# EAGLE schematic WB_2.8 (EAGLE 6.4)
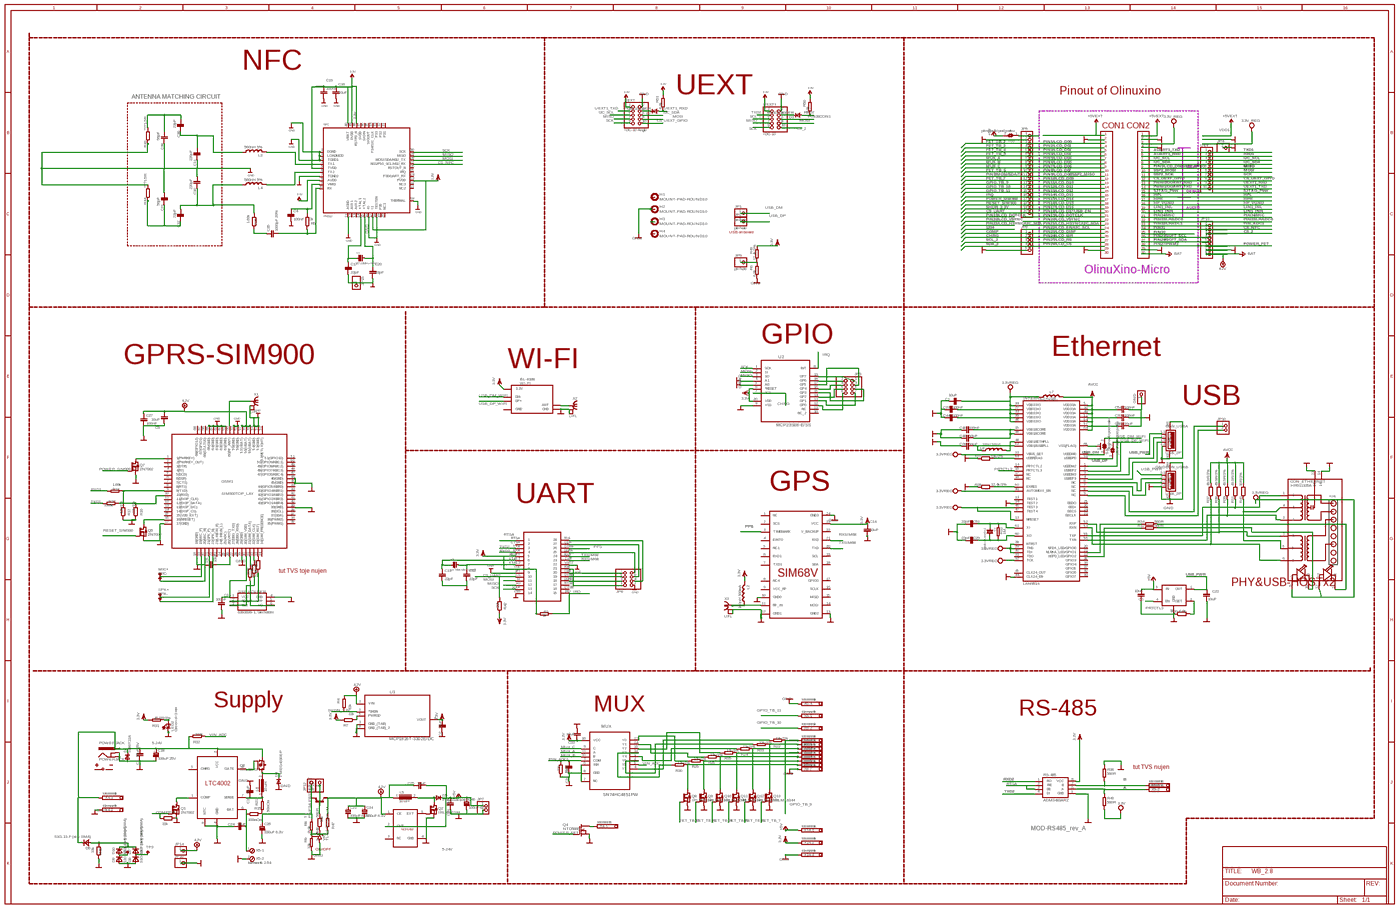
[diagram p0: schematic, sheet 1, overview]
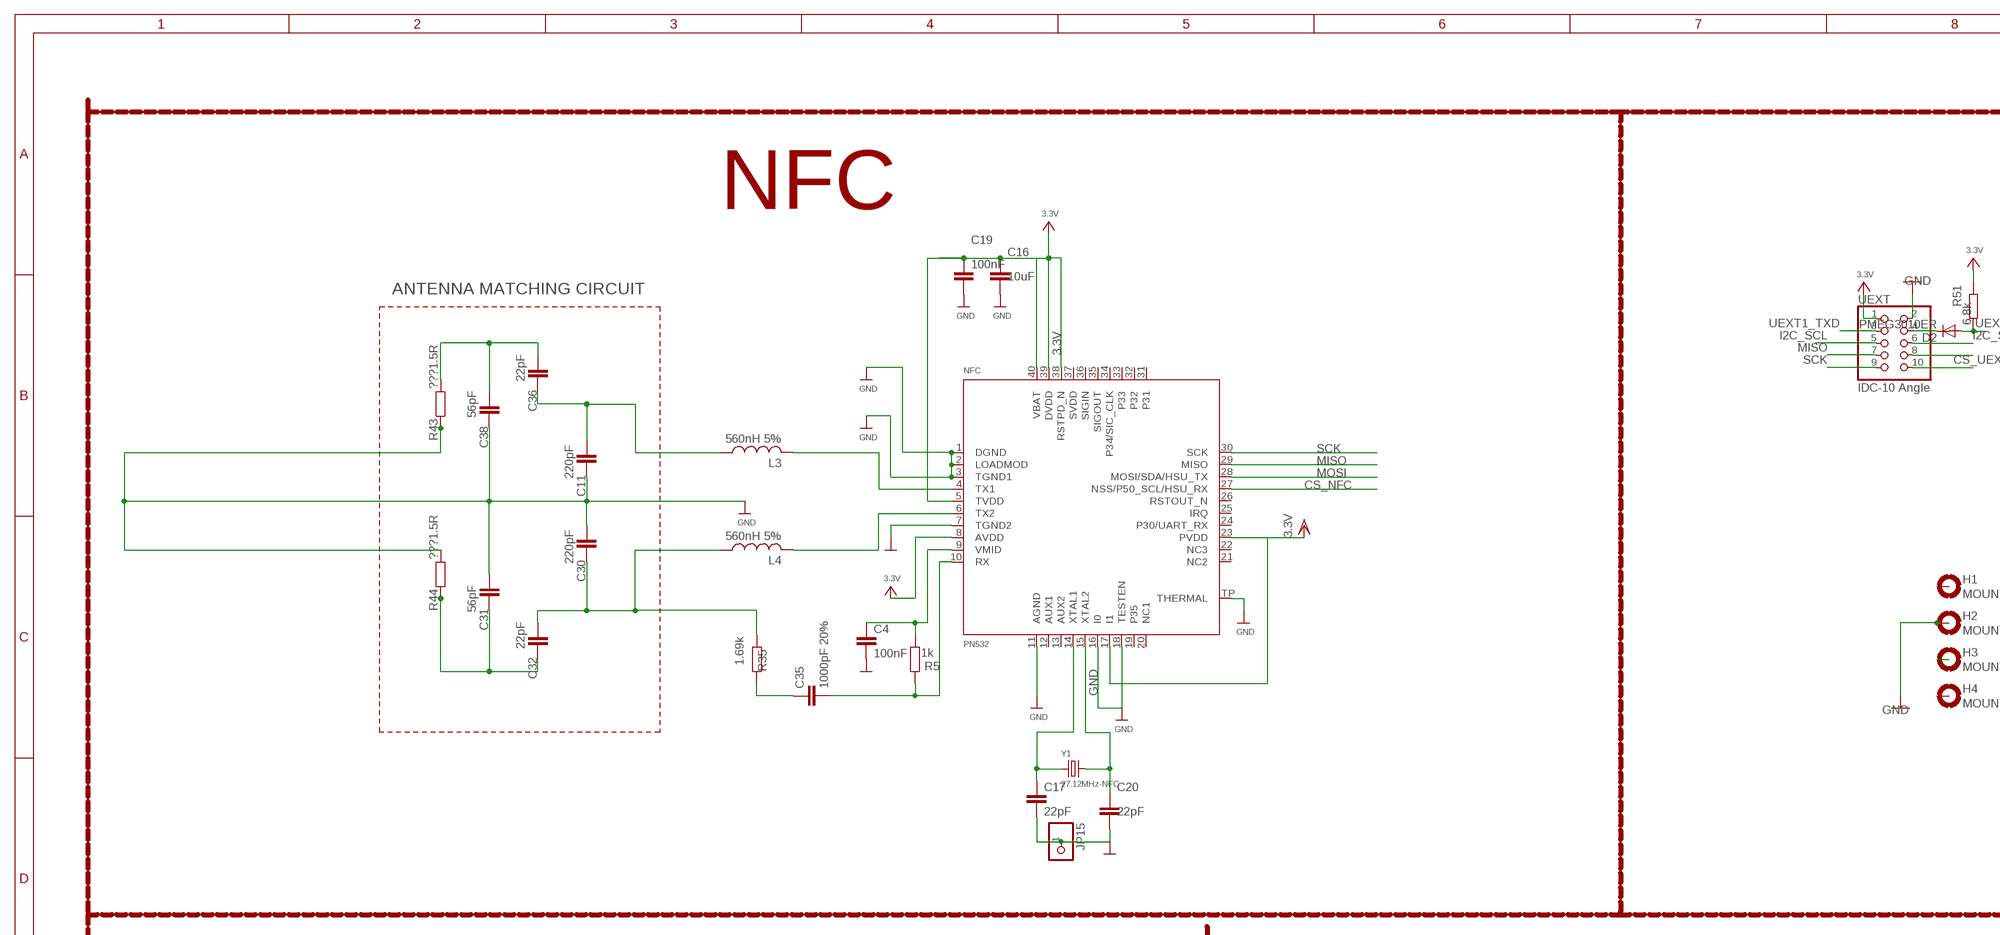
[diagram p1: schematic, sheet 1, part 1 of 4]
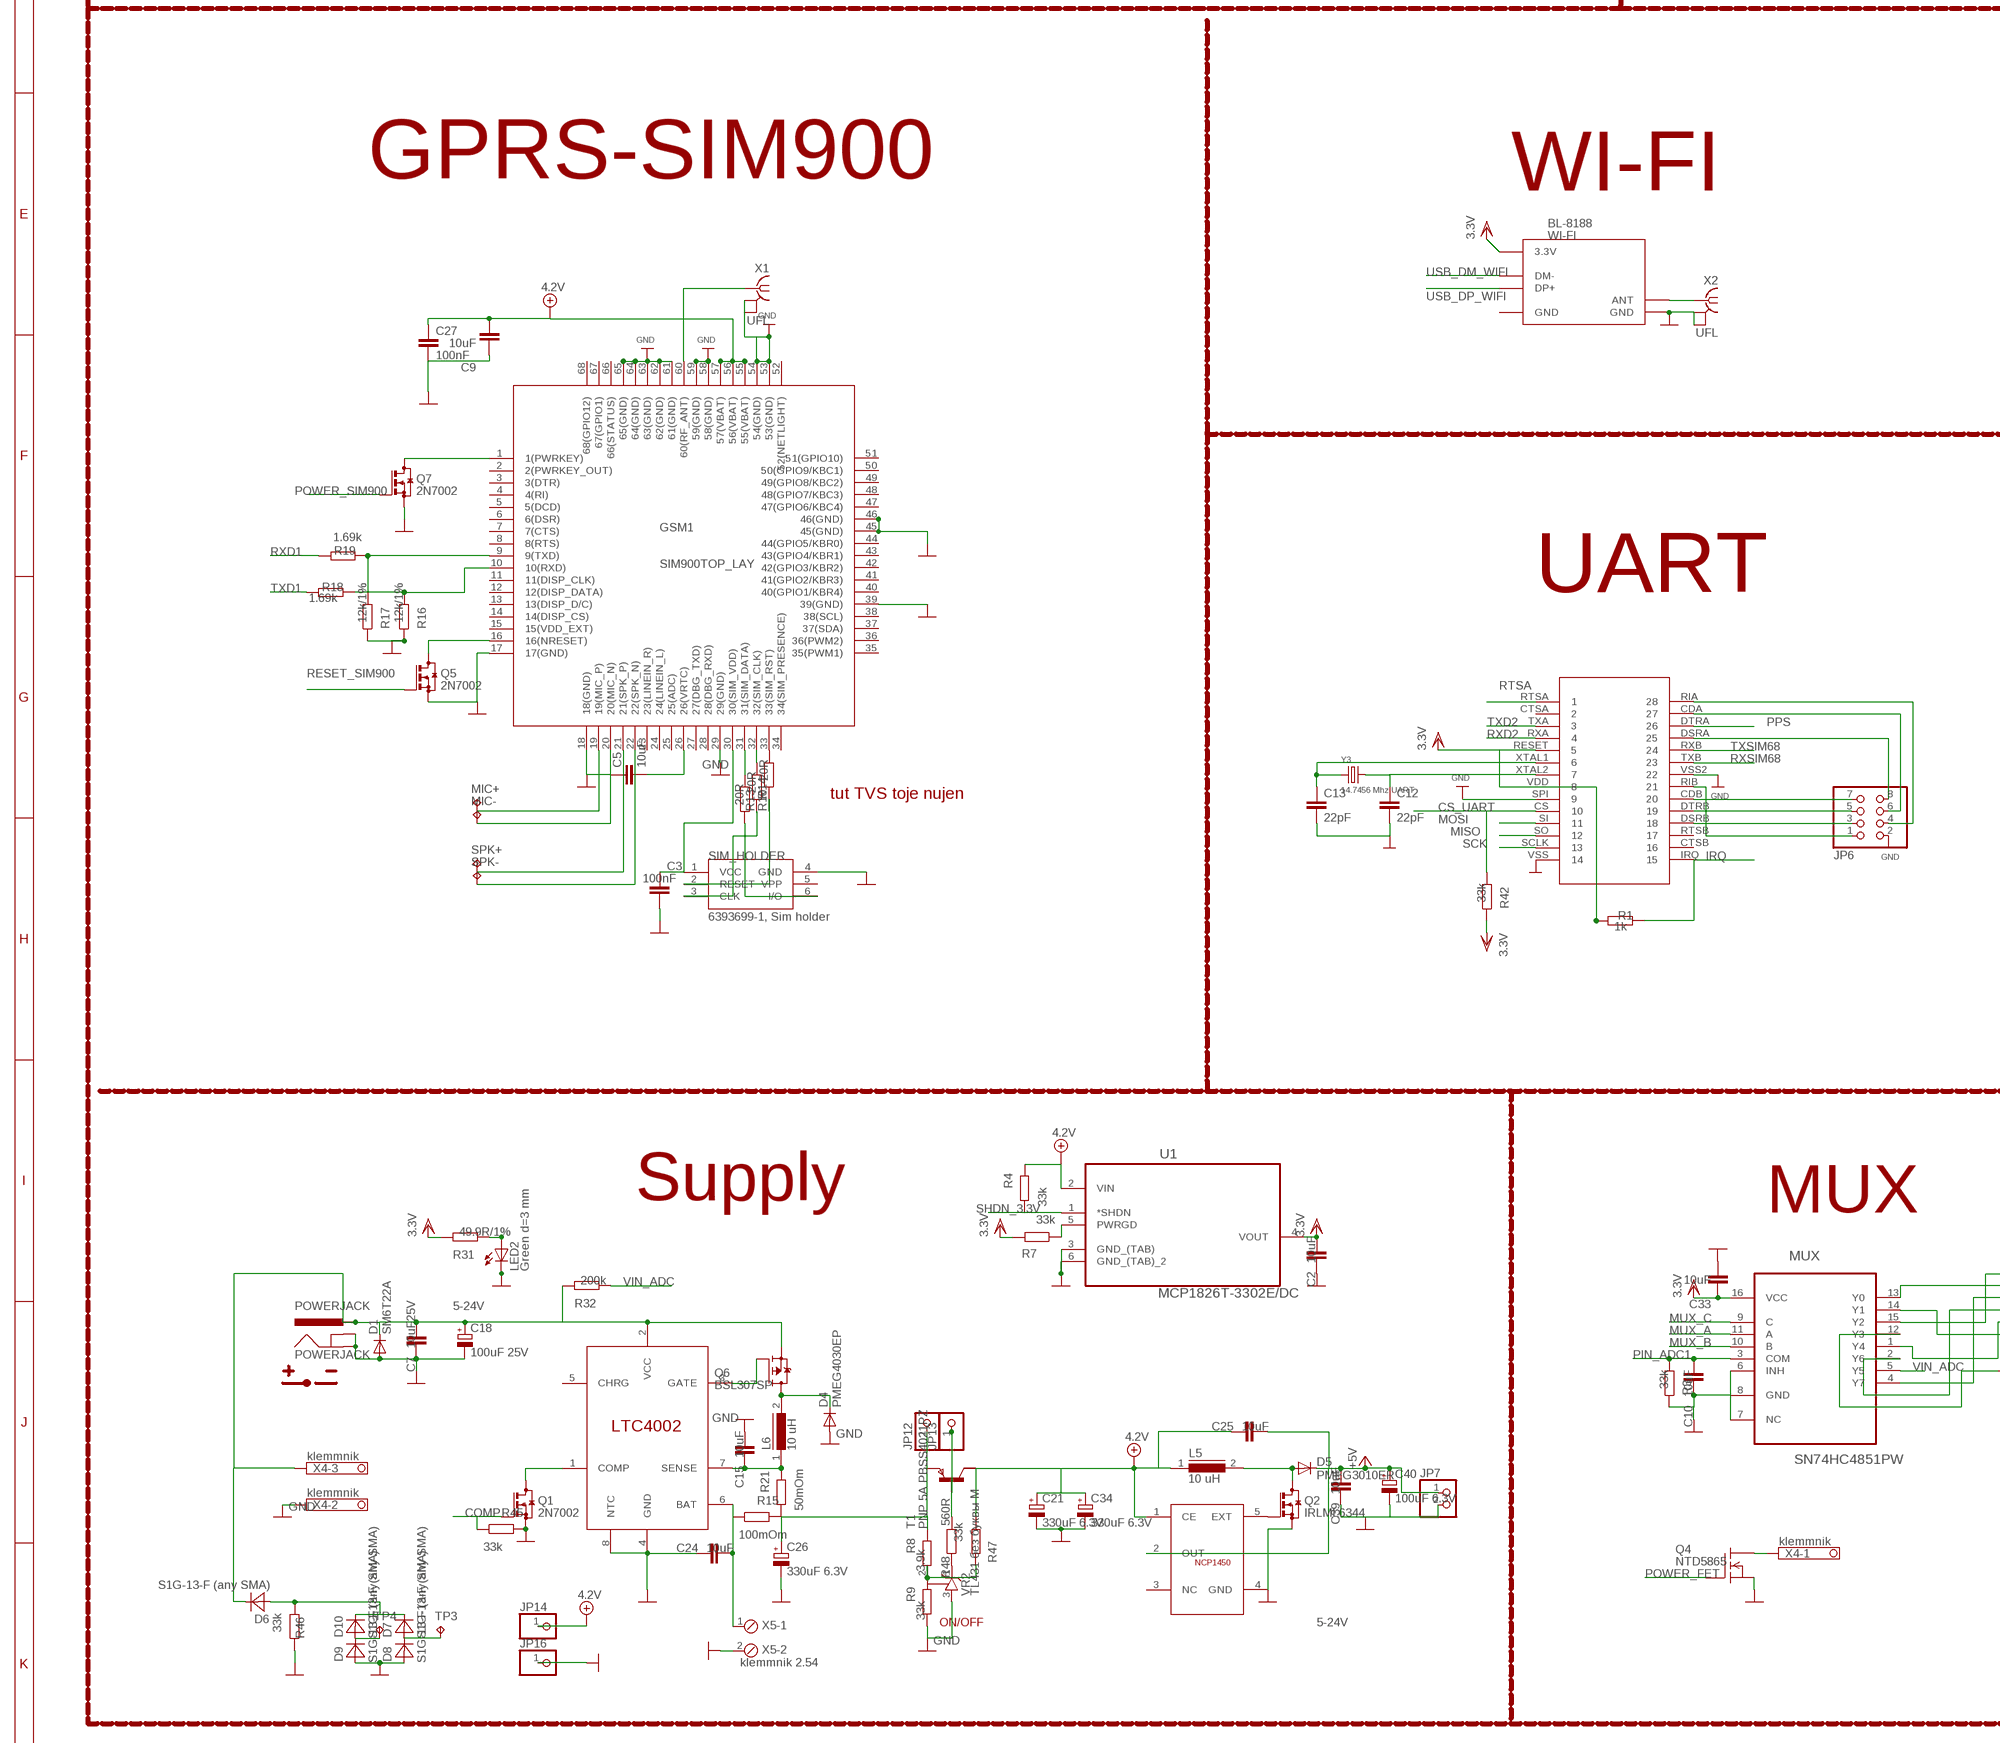
[diagram p2: schematic, sheet 1, part 2 of 4]
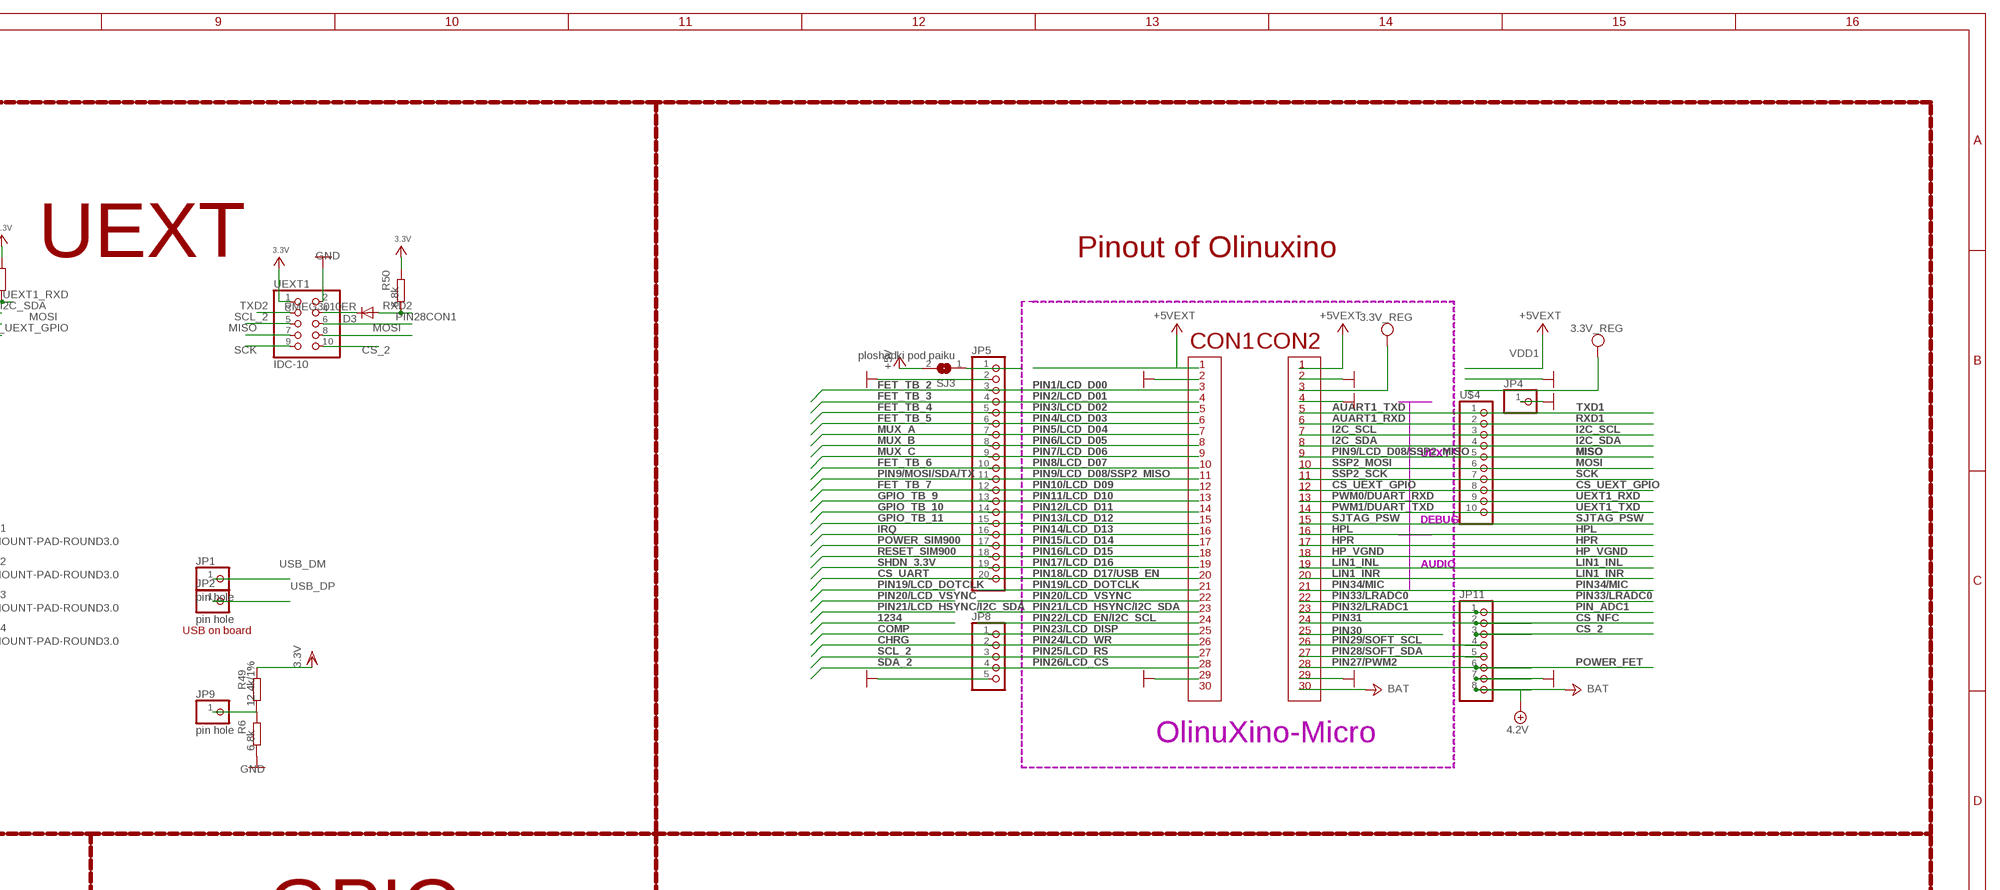
[diagram p3: schematic, sheet 1, part 3 of 4]
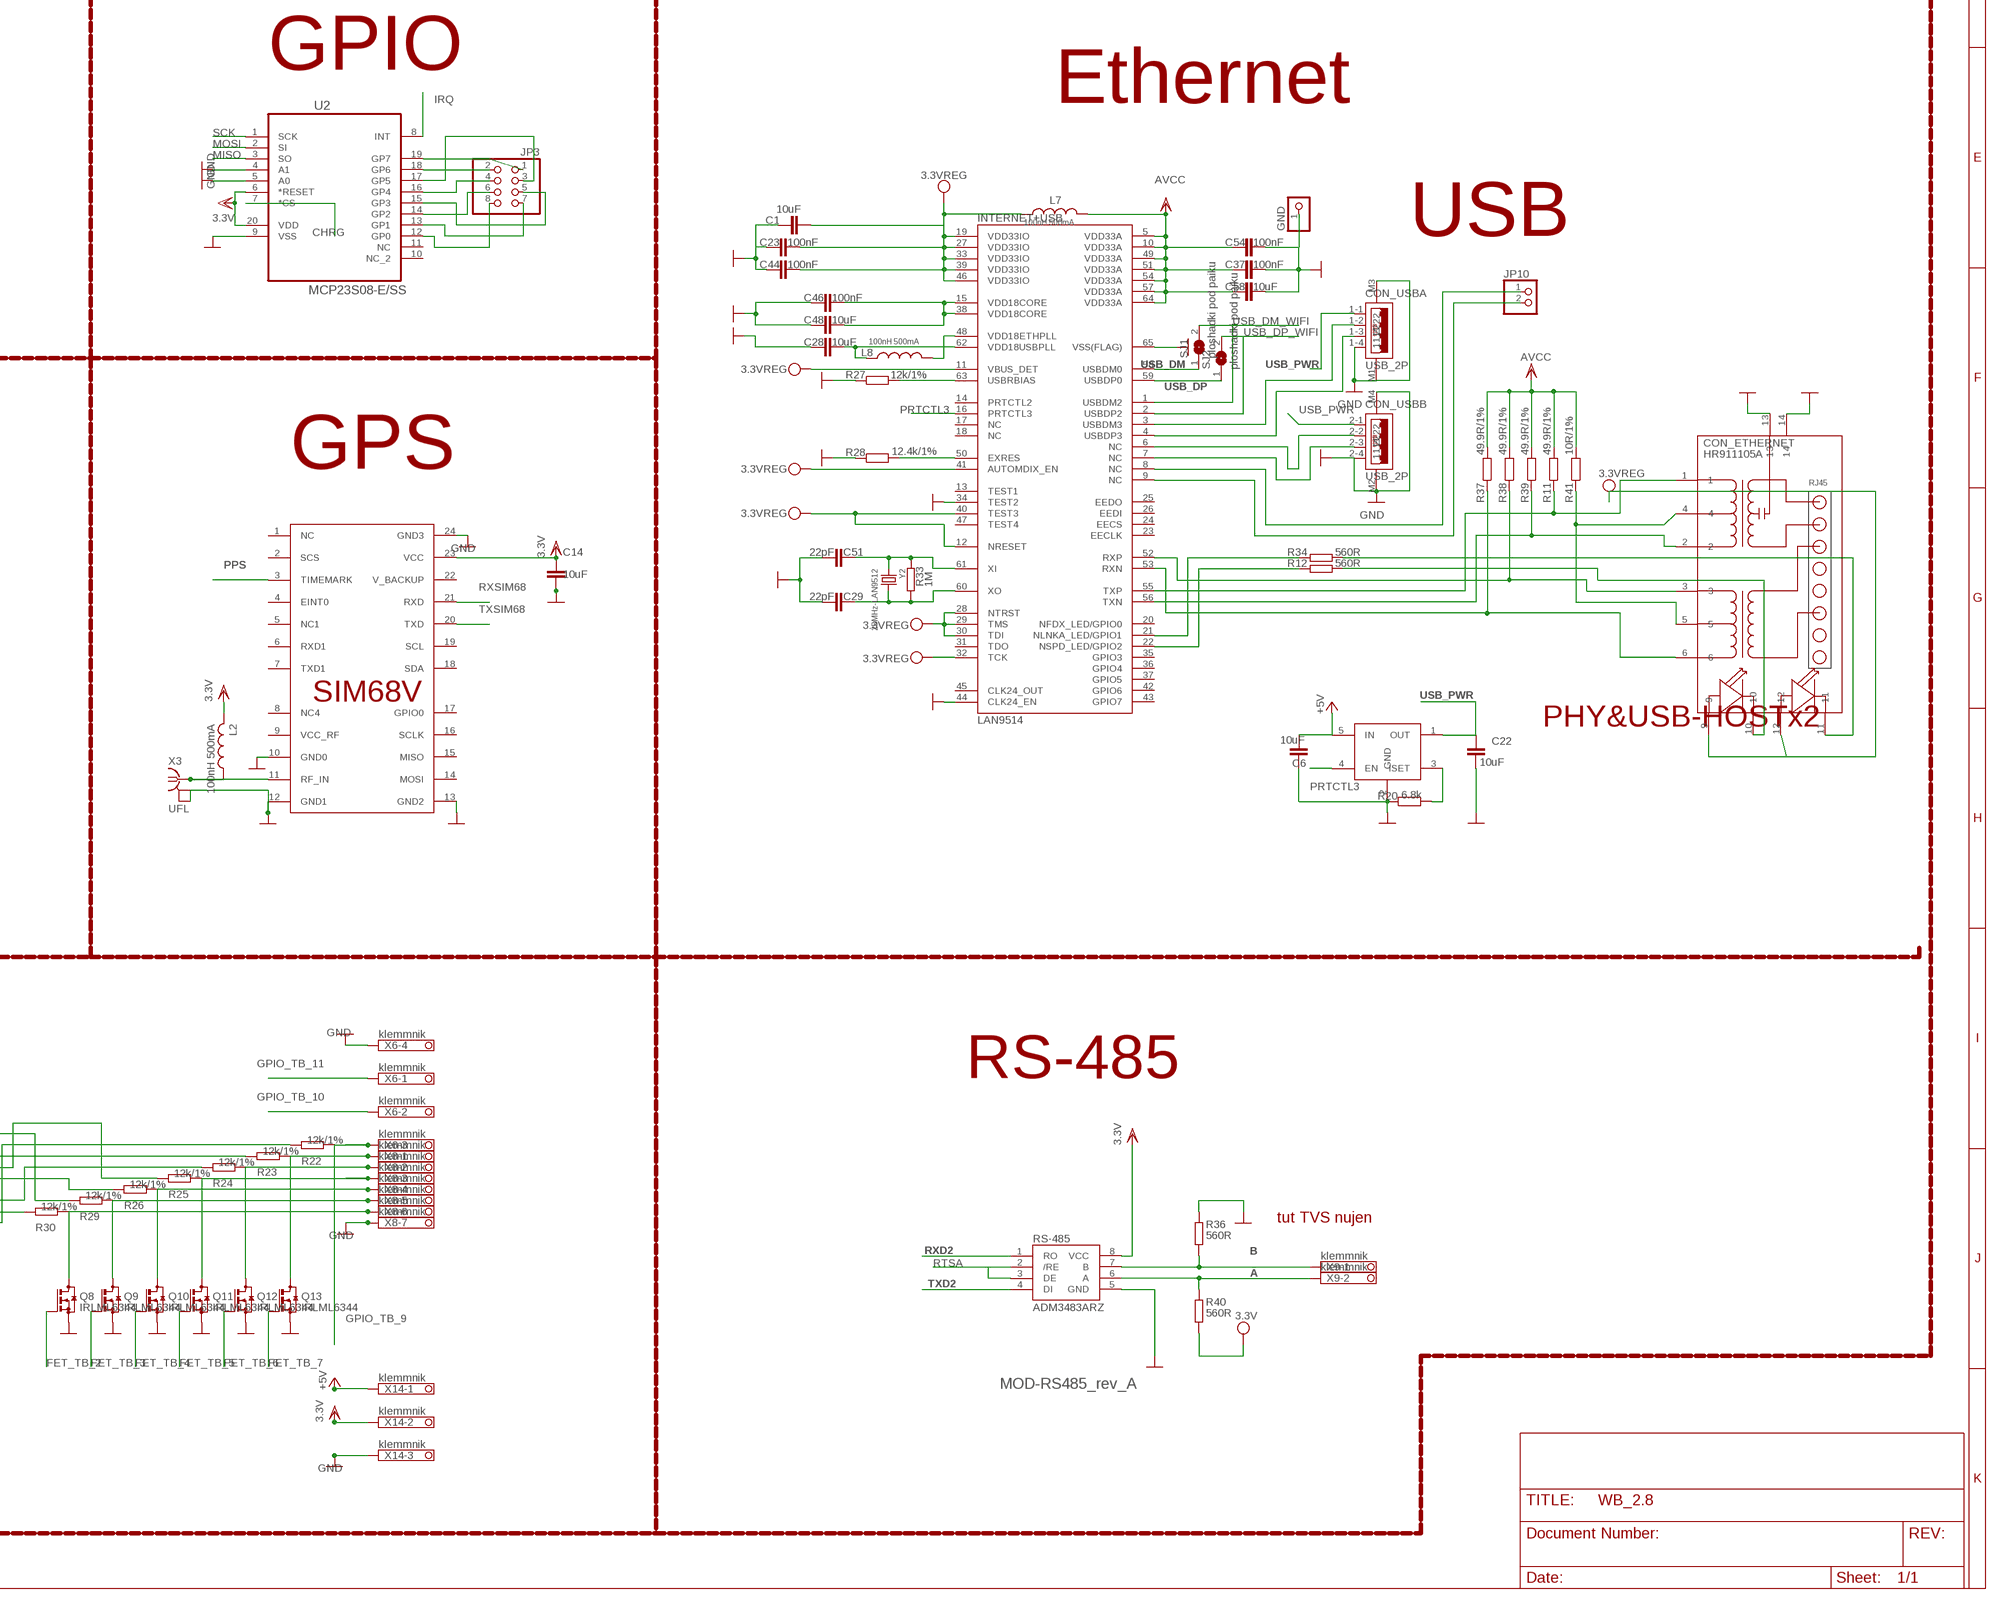
[diagram p4: schematic, sheet 1, part 4 of 4]

## Parts
C1  10uF  C-EUC0805_5MIL_D  [C0805_5MIL_D]
C2  10uF  C-EUC0805_5MIL_D  [C0805_5MIL_D]
C3  100nF  C-EUC0805_5MIL_D  [C0805_5MIL_D]
C4  100nF  C-EUC0805_5MIL_D  [C0805_5MIL_D]
C5  10uF  C-EUC0805_5MIL_D  [C0805_5MIL_D]
C6  10uF  C-EUC0805_5MIL_D  [C0805_5MIL_D]
C7  10uF25V  C-EUC0805_5MIL_D  [C0805_5MIL_D]
C9  10uF  C-EUC0805_5MIL_D  [C0805_5MIL_D]
C10  10uF  C-EUC0805_5MIL_D  [C0805_5MIL_D]
C11  220pF  C-EUC0805_5MIL_D  [C0805_5MIL_D]
C12  22pF  C-EUC0805_5MIL_D  [C0805_5MIL_D]
C13  22pF  C-EUC0805_5MIL_D  [C0805_5MIL_D]
C14  10uF  C-EUC0805_5MIL_D  [C0805_5MIL_D]
C15  10uF  C-EUC0805_5MIL_D  [C0805_5MIL_D]
C16  10uF  C-EUC0805_5MIL_D  [C0805_5MIL_D]
C17  22pF  C-EUC0805_5MIL_D  [C0805_5MIL_D]
C18  100uF 25V  CPOL-EUD  [PANASONIC_D]
C19  100nF  C-EUC0805_5MIL_D  [C0805_5MIL_D]
C20  22pF  C-EUC0805_5MIL_D  [C0805_5MIL_D]
C21  330uF 6.3V  CPOL-EUD  [PANASONIC_D]
C22  10uF  C-EUC0805_5MIL_D  [C0805_5MIL_D]
C23  100nF  C-EUC0805_5MIL_D  [C0805_5MIL_D]
C24  10uF  C-EUC0805_5MIL_D  [C0805_5MIL_D]
C25  10uF  C-EUC0805_5MIL_D  [C0805_5MIL_D]
C26  330uF 6.3V  CPOL-EUD  [PANASONIC_D]
C27  100nF  C-EUC0805_5MIL_D  [C0805_5MIL_D]
C28  10uF  C-EUC0805_5MIL_D  [C0805_5MIL_D]
C29  22pF  C-EUC0805_5MIL_D  [C0805_5MIL_D]
C30  220pF  C-EUC0805_5MIL_D  [C0805_5MIL_D]
C31  56pF  C-EUC0805_5MIL_D  [C0805_5MIL_D]
C32  22pF  C-EUC0805_5MIL_D  [C0805_5MIL_D]
C33  10uF  C-EUC0805_5MIL_D  [C0805_5MIL_D]
C34  330uF 6.3V  CPOL-EUD  [PANASONIC_D]
C35  1000pF 20%  C-EUC0805_5MIL_D  [C0805_5MIL_D]
C36  22pF  C-EUC0805_5MIL_D  [C0805_5MIL_D]
C37  100nF  C-EUC0805_5MIL_D  [C0805_5MIL_D]
C38  56pF  C-EUC0805_5MIL_D  [C0805_5MIL_D]
C39  10uF  C-EUC0805_5MIL_D  [C0805_5MIL_D]
C40  100uF 6.3V  CPOL-EUD  [PANASONIC_D]
C44  100nF  C-EUC0805_5MIL_D  [C0805_5MIL_D]
C46  100nF  C-EUC0805_5MIL_D  [C0805_5MIL_D]
C48  10uF  C-EUC0805_5MIL_D  [C0805_5MIL_D]
C51  22pF  C-EUC0805_5MIL_D  [C0805_5MIL_D]
C54  100nF  C-EUC0805_5MIL_D  [C0805_5MIL_D]
C58  10uF  C-EUC0805_5MIL_D  [C0805_5MIL_D]
CON_ETHERNET  HR911105A  [HR911105A]
CON_USB  USB_2P  USB_2P-  [2P]
D1  SM6T22A  DIODE-DO214AA  [DO214AA]
D2  PMEG3010ER  DIODE-SOD123  [SOD123]
D3  PMEG3010ER  DIODE-SOD123  [SOD123]
D4  PMEG4030EP  DIODE-DO214AC  [DO214AC]
D5  PMEG3010ER  DIODE-SOD123  [SOD123]
D6  S1G-13-F (any SMA)  MBRA340T3  [SMA]
D7  S1G-13-F (any SMA)  MBRA340T3  [SMA]
D8  S1G-13-F (any SMA)  MBRA340T3  [SMA]
D9  S1G-13-F (any SMA)  MBRA340T3  [SMA]
D10  S1G-13-F (any SMA)  MBRA340T3  [SMA]
GND  PINHD-1X1CB  [1X01-CLEANBIG]
GSM1  SIM900TOP_LAY  [SMT]
H1  MOUNT-PAD-ROUND3.0  [3,0-PAD]
H2  MOUNT-PAD-ROUND3.0  [3,0-PAD]
H3  MOUNT-PAD-ROUND3.0  [3,0-PAD]
H4  MOUNT-PAD-ROUND3.0  [3,0-PAD]
INTERNET+USB  LAN9514  LAN9512-JZX  [QFN64]
JP1  pin hole  PINHD-1X1  [1X01@1]
JP2  pin hole  PINHD-1X1  [1X01@1]
JP3  PINHD-2X4  [2X04]
JP4  PINHD-1X1  [1X01]
JP5  PINHD-1X20  [1X20]
JP6  PINHD-2X4  [2X04]
JP7  PINHD-1X2  [1X02]
JP8  PINHD-1X5  [1X05]
JP9  pin hole  PINHD-1X1  [1X01]
JP10  PINHD-1X2  [1X02]
JP11  PINHD-1X8BIG  [1X08-BIG]
JP12  PINHD-1X1  [1X01]
JP13  PINHD-1X1  [1X01]
JP14  PINHD-1X1  [1X01@1]
JP15  PINHD-1X1CB  [1X01-CLEANBIG]
JP16  PINHD-1X1  [1X01@1]
L2  100nH 500mA  L-USL0805_5MIL_D  [L0805_5MIL_D]
L3  560nH 5%  L-USL0805_5MIL_D  [L0805_5MIL_D]
L4  560nH 5%  L-USL0805_5MIL_D  [L0805_5MIL_D]
L5  10 uH  DR74  [DR74]
L6  10 uH  DR74  [DR74]
L7  100nH 500mA  L-USL0805_5MIL_D  [L0805_5MIL_D]
L8  100nH 500mA  L-USL0805_5MIL_D  [L0805_5MIL_D]
LED2  Green d=3 mm  LED3MM  [LED3MM]
MIC+  PAD  TPTP20R  [TP20R]
MIC-  PAD  TPTP20R  [TP20R]
MUX  SN74HC4851PW  [SOP65P640X120-16N]
NFC  PN532  [HVQFN40-6X6]
POWER_5V  NCP1450ASN50T1G  NCP1450TSOP-5  [SO-6/4]
POWERJACK  POWERJACK  1  [1]
Q1  2N7002  BSS123  [SOT23]
Q2  IRLML6344  BSS123  [SOT23]
Q4  NTD5865  BUZ24  [DPAK]
Q5  2N7002  BSS123  [SOT23]
Q6  BSL307SP  [SC74_INFINEON]
Q7  2N7002  BSS123  [SOT23]
Q8  IRLML6344  BSS123  [SOT23]
Q9  IRLML6344  BSS123  [SOT23]
Q10  IRLML6344  BSS123  [SOT23]
Q11  IRLML6344  BSS123  [SOT23]
Q12  IRLML6344  BSS123  [SOT23]
Q13  IRLML6344  BSS123  [SOT23]
R1  1k  R-EU_R0805_5MIL_D  [R0805_5MIL_D]
R3  33k  R-EU_R0805_5MIL_D  [R0805_5MIL_D]
R4  33k  R-EU_R0805_5MIL_D  [R0805_5MIL_D]
R5  1k  R-EU_R0805_5MIL_D  [R0805_5MIL_D]
R6  6.8k  R-EU_R0805_5MIL_D  [R0805_5MIL_D]
R7  33k  R-EU_R0805_5MIL_D  [R0805_5MIL_D]
R8  3.9k  R-EU_R0805_5MIL_D  [R0805_5MIL_D]
R9  33k  R-EU_R0805_5MIL_D  [R0805_5MIL_D]
R10  20R  R-EU_R0805_5MIL_D  [R0805_5MIL_D]
R11  49.9R/1%  R-EU_R0805_5MIL_D  [R0805_5MIL_D]
R12  560R  R-EU_R0805_5MIL_D  [R0805_5MIL_D]
R13  20R  R-EU_R0805_5MIL_D  [R0805_5MIL_D]
R14  20R  R-EU_R0805_5MIL_D  [R0805_5MIL_D]
R15  100mOm  R-EU_R1206  [R1206]
R16  12k/1%  R-EU_R0805_5MIL_D  [R0805_5MIL_D]
R17  12k/1%  R-EU_R0805_5MIL_D  [R0805_5MIL_D]
R18  1.69k  R-EU_R0805_5MIL_D  [R0805_5MIL_D]
R19  1.69k  R-EU_R0805_5MIL_D  [R0805_5MIL_D]
R20  6.8k  R-EU_R0805_5MIL_D  [R0805_5MIL_D]
R21  50mOm  R-EU_R1206  [R1206]
R22  12k/1%  R-EU_R0805_5MIL_D  [R0805_5MIL_D]
R23  12k/1%  R-EU_R0805_5MIL_D  [R0805_5MIL_D]
R24  12k/1%  R-EU_R0805_5MIL_D  [R0805_5MIL_D]
R25  12k/1%  R-EU_R0805_5MIL_D  [R0805_5MIL_D]
R26  12k/1%  R-EU_R0805_5MIL_D  [R0805_5MIL_D]
R27  12k/1%  R-EU_R0805_5MIL_D  [R0805_5MIL_D]
R28  12.4k/1%  R-EU_R0805_5MIL_D  [R0805_5MIL_D]
R29  12k/1%  R-EU_R0805_5MIL_D  [R0805_5MIL_D]
R30  12k/1%  R-EU_R0805_5MIL_D  [R0805_5MIL_D]
R31  49.9R/1%  R-EU_R0805_5MIL_D  [R0805_5MIL_D]
R32  200k  R-EU_R0805_5MIL_D  [R0805_5MIL_D]
R33  1M  R-EU_R0805_5MIL_D  [R0805_5MIL_D]
R34  560R  R-EU_R0805_5MIL_D  [R0805_5MIL_D]
R35  1.69k  R-EU_R0805_5MIL_D  [R0805_5MIL_D]
R36  560R  R-EU_R0805_5MIL_D  [R0805_5MIL_D]
R37  49.9R/1%  R-EU_R0805_5MIL_D  [R0805_5MIL_D]
R38  49.9R/1%  R-EU_R0805_5MIL_D  [R0805_5MIL_D]
R39  49.9R/1%  R-EU_R0805_5MIL_D  [R0805_5MIL_D]
R40  560R  R-EU_R0805_5MIL_D  [R0805_5MIL_D]
R41  10R/1%  R-EU_R0805_5MIL_D  [R0805_5MIL_D]
R42  33k  R-EU_R0805_5MIL_D  [R0805_5MIL_D]
R43  ???1.5R  R-EU_R0805_5MIL_D  [R0805_5MIL_D]
R44  ???1.5R  R-EU_R0805_5MIL_D  [R0805_5MIL_D]
R45  33k  R-EU_R0805_5MIL_D  [R0805_5MIL_D]
R46  33k  R-EU_R0805_5MIL_D  [R0805_5MIL_D]
R47  33k  R-EU_R0805_5MIL_D  [R0805_5MIL_D]
R48  560R  R-EU_R0805_5MIL_D  [R0805_5MIL_D]
R49  12.4k/1%  R-EU_R0805_5MIL_D  [R0805_5MIL_D]
R50  6.8k  R-EU_R0805_5MIL_D  [R0805_5MIL_D]
R51  6.8k  R-EU_R0805_5MIL_D  [R0805_5MIL_D]
RS-485  ADM3483ARZ  ADM3483  [SOIC8]
SIM68  SIM68  [SIM68V]
SIM_HOLDER  6393699-1, Sim holder  BIGSIM  [BIGSIM]
SJ1  ploshadki pod paiku  SJ  [SJ]
SJ2  ploshadki pod paiku  SJ  [SJ]
SJ3  ploshadki pod paiku  SJ  [SJ]
SPK+  PAD  TPTP20R  [TP20R]
SPK-  PAD  TPTP20R  [TP20R]
T1  PNP 5A PBSS4021PZ  PNPSOT223  [SOT223]
TP3  contact for POE  TPB1,27  [B1,27]
TP4  contact for POE  TPB1,27  [B1,27]
U1  MCP1826T-3302E/DC  [SOT230P700X180-6N]
U2  MCP23S08-E/SS  [SOP65P780X200-20N]
U$3  LTC4002ES8-4.2  LTC4002-SOIC  [SOIC-8]
U$4  PINHD-1X10  [1X10-BIG]
U$15  SY6280  [SOT23-5L]
UART  !SC16IS752  [TSSOP28]
UEXT  IDC-10 Angle  PINHD-2X5/90  [2X05/90]
UEXT1  IDC-10  PINHD-2X5  [2X05]
VR2  TL431 без буквы M  TL431CLPSOT23-3  [SOT23]
WI-FI  BL-8188  [BL-8188-PACK]
X1  UFL  MC-921  [MC-921]
X2  UFL  MC-921  [MC-921]
X3  UFL  MC-921  [MC-921]
X4  klemmnik  1751251  [1751251]
X5  klemmnik 2.54  MPT2  [2POL254]
X6  klemmnik  1751264  [1751264]
X8  klemmnik  1751293  [1751293]
X9  klemmnik  1751248  [1751248]
X14  klemmnik  1751251  [1751251]
Y1  27.12MHz-NFC  CRYSTALTHIN  [CRYSTAL_3.2X2.5]
Y2  25MHz-LAN9512  CRYSTALTHIN  [CRYSTAL_3.2X2.5]
Y3  14.7456 Mhz UART  CRYSTALTHIN  [CRYSTAL_3.2X2.5]

## Nets
3.3V: C1.2 C2.2 C14.1 C16.1 C19.1 C23.2 C33.1 C44.2 CON_ETHERNET.9 CON_ETHERNET.12 INTERNET+USB.11(VBUS_DET) INTERNET+USB.12(NRESET) INTERNET+USB.19(VDD33IO) INTERNET+USB.27(VDD33IO) INTERNET+USB.28(NTRST) INTERNET+USB.29(TMS) INTERNET+USB.30(TDI) INTERNET+USB.32(TCK) INTERNET+USB.33(VDD33IO) INTERNET+USB.39(VDD33IO) INTERNET+USB.40(TEST3) INTERNET+USB.41(AUTOMDIX_EN) INTERNET+USB.46(VDD33IO) L2.2 L7.1 MUX.16(VCC) NFC.5(TVDD) NFC.8(AVDD) NFC.17(I1) NFC.23(PVDD) NFC.38(RSTPD_N) NFC.39(DVDD) NFC.40(VBAT) R1.2 R7.2 R31.1 R40.1 R42.1 R49.2 R50.2 R51.2 RS-485.8(VCC) SIM68.23(VCC) U1.4(VOUT) U2.6(*RESET) U2.20(VDD) UART.RESET UART.VDD UEXT1.1 UEXT.1 WI-FI.3.3V X14.2 ; supply symbol labelled 3.3VREG
5-24V: C7.2 C18.+ D1.C D6.C POWERJACK.1(PWR) Q6.4(S) R32.1 U$3.2(VCC) X4.3
+4.1V: C9.2 C21.+ C25.1 C27.1 C34.+ GSM1.55(55(VBAT)) GSM1.56(56(VBAT)) GSM1.57(57(VBAT)) JP11.8 JP14.1 L5.1 POWER_5V.1(CE) R4.2 R47.1 T1.4(C1) U1.2(VIN) ; supply symbol labelled 4.2V, BAT
+5V: C6.1 C25.2 C39.2 C40.+ D5.C JP7.1 POWER_5V.2(OUT) SJ3.2 U$15.5(IN) X14.1 ; supply symbol labelled +5VEXT
A: R40.2 RS-485.6(A) X9.2
B: R36.1 RS-485.7(B) X9.1
CHRG: JP8.2 U2.7(*CS)
COMP: JP8.1 Q1.1(G) R45.1
CS_2: JP11.3 UEXT1.10
CS_NFC: JP11.2 NFC.27(NSS/P50_SCL/HSU_RX)
CS_UART: JP5.20 R42.2 UART.CS
CS_UEXT_GPIO: U$4.8 UEXT.10
DFGSDFG: Q13.3(D) R23.2 X8.1
DFTGSDFG: MUX.15(Y2) R25.1
ERTERVT: MUX.12(Y3) R30.1
FDSGSDFGSDF: JP11.5
FET_TB_2: JP5.3 Q8.1(G)
FET_TB_3: JP5.4 Q9.1(G)
FET_TB_4: JP5.5 Q10.1(G)
FET_TB_5: JP5.6 Q11.1(G)
FET_TB_6: JP5.10 Q12.1(G)
FET_TB_7: JP5.12 Q13.1(G)
GND: C1.1 C2.1 C3.2 C4.2 C5.1 C6.2 C7.1 C9.1 C10.1 C11.1 C12.2 C13.2 C14.2 C15.2 C16.2 C17.2 C18.- C19.2 C20.2 C21.- C22.2 C23.1 C24.1 C26.- C27.2 C28.1 C29.2 C30.2 C31.2 C33.2 C34.- C37.2 C38.1 C39.1 C40.- C44.1 C46.1 C48.1 C51.2 C54.2 C58.2 CON_ETHERNET.13 CON_ETHERNET.14 CON_USB.1-4 CON_USB.2-4 CON_USB.M1 CON_USB.M2 CON_USB.M3 CON_USB.M4 D1.A D4.A D8.A D9.A GND.1 GSM1.17(17(GND)) GSM1.18(18(GND)) GSM1.29(29(GND)) GSM1.39(39(GND)) GSM1.45(45(GND)) GSM1.46(46(GND)) GSM1.53(53(GND)) GSM1.54(54(GND)) GSM1.58(58(GND)) GSM1.59(59(GND)) GSM1.61(61(GND)) GSM1.62(62(GND)) GSM1.63(63(GND)) GSM1.64(64(GND)) GSM1.65(65(GND)) H2.B3,0(MOUNT) INTERNET+USB.34(TEST2) INTERNET+USB.44(CLK24_EN) INTERNET+USB.65(VSS(FLAG)) JP4.1 JP5.2 JP6.2 JP7.2 JP8.5 JP11.7 JP15.1 JP16.1 LED2.K(C) MUX.6(INH) MUX.7(NC) MUX.8(GND) NFC.1(DGND) NFC.2(LOADMOD) NFC.3(TGND1) NFC.7(TGND2) NFC.11(AGND) NFC.16(I0) NFC.18(TESTEN) NFC.TP(THERMAL) POWER_5V.4(GND) POWERJACK.P$1(GNDBREAK) POWERJACK.P$5(GND) Q1.2(S) Q2.2(S) Q4.3(S) Q5.2(S) Q7.2(S) Q8.2(S) Q9.2(S) Q10.2(S) Q11.2(S) Q12.2(S) Q13.2(S) R3.1 R6.1 R9.1 R16.1 R17.1 R20.1 R27.1 R28.1 R36.2 R43.1 R44.2 R45.2 R46.1 RS-485.5(GND) SIM68.10(GND0) SIM68.12(GND1) SIM68.13(GND2) SIM68.24(GND3) SIM_HOLDER.4(GND) U1.3(GND_(TAB)) U1.6(GND_(TAB)_2) U2.4(A1) U2.5(A0) U2.9(VSS) U$3.4(GND) U$3.8(NTC) U$15.2(GND) UART.SPI UART.VSS UART.VSS2 UEXT1.2 UEXT.2 VR2.3(A) WI-FI.GND2(GND) X1.2@1(GND) X1.2@2(GND) X2.2@1(GND) X2.2@2(GND) X3.2@1(GND) X3.2@2(GND) X4.2 X5.2 X6.4 X8.7 X14.3
GPIO_TB_9: JP5.13 R22.2 X6.3
GPIO_TB_10: JP5.14 X6.2
GPIO_TB_11: JP5.15 X6.1
I2C_SCL: U$4.3 UEXT.5
I2C_SDA: U$4.4 UEXT.6
IRQ: JP5.16 R1.1 U2.8(INT) UART.IRQ
MISO: NFC.29(MISO) U2.3(SO) U$4.5 UART.SO UEXT1.7 UEXT.7
MOSI: NFC.28(MOSI/SDA/HSU_TX) U2.2(SI) U$4.6 UART.SI UEXT1.8 UEXT.8
MUX_A: JP5.7 MUX.11(A)
MUX_B: JP5.8 MUX.10(B)
MUX_C: JP5.9 MUX.9(C)
N$1: L3.2 NFC.4(TX1)
N$2: L4.2 NFC.6(TX2)
N$3: C11.2 C36.1 L3.1
N$4: GSM1.16(16(NRESET)) Q5.3(D)
N$5: JP13.1 R48.2 T1.1(B)
N$6: GSM1.9(9(TXD)) R17.2 R19.1
N$7: C17.1 NFC.14(XTAL1) Y1.1
N$8: C20.1 NFC.15(XTAL2) Y1.2
N$9: C35.1 R35.1
N$10: C4.1 NFC.9(VMID) R5.2
N$11: C35.2 NFC.10(RX) R5.1
N$12: C30.1 C32.2 L4.1 R35.2
N$13: R10.1 SIM_HOLDER.6(I/O)
N$14: GSM1.33(33(SIM_RST)) R14.2
N$16: R13.1 SIM_HOLDER.3(CLK)
N$17: WI-FI.ANT X2.1
N$18: R14.1 SIM_HOLDER.2(RESET)
N$19: C26.+ JP12.1 R8.2 R15.2 R21.1 T1.3(E)
N$20: GSM1.31(31(SIM_DATA)) R10.2
N$21: GSM1.1(1(PWRKEY)) Q7.3(D)
N$22: C5.2 GSM1.26(26(VRTC))
N$23: GSM1.60(60(RF_ANT)) X1.1
N$24: Q6.3(G) U$3.3(GATE)
N$25: C46.2 C48.2 INTERNET+USB.15(VDD18CORE) INTERNET+USB.38(VDD18CORE)
N$26: JP6.3 UART.DSRB
N$27: GSM1.32(32(SIM_CLK)) R13.2
N$28: L2.1 SIM68.11(RF_IN) X3.1
N$29: C13.1 UART.XTAL1 Y3.1
N$30: C12.1 UART.XTAL2 Y3.2
N$31: C3.1 GSM1.30(30(SIM_VDD)) SIM_HOLDER.1(VCC)
N$32: Q4.4(D) X4.1
N$33: GSM1.10(10(RXD)) R16.2 R18.1
N$34: JP3.1 U2.19(GP7)
N$35: INTERNET+USB.48(VDD18ETHPLL) L8.2
N$36: C28.2 INTERNET+USB.62(VDD18USBPLL) L8.1
N$37: INTERNET+USB.63(USBRBIAS) R27.2
N$38: INTERNET+USB.50(EXRES) R28.2
N$39: R48.1 VR2.1(C)
N$40: MUX.1(Y4) R24.1
N$41: R20.2 U$15.3(ISET)
N$42: Q12.3(D) R24.2 X8.2
N$43: Q11.3(D) R25.2 X8.3
N$44: Q10.3(D) R26.2 X8.4
N$45: Q9.3(D) R29.2 X8.5
N$46: Q8.3(D) R30.2 X8.6
N$47: C15.1 L6.1 R21.2 U$3.7(SENSE)
N$48: MUX.4(Y7) R22.1
N$49: MUX.2(Y6) R23.1
N$50: D7.A D8.C TP3.TP
N$51: LED2.A R31.2
N$52: MUX.14(Y1) R26.1
N$53: D4.C L6.2 Q6.1(D) Q6.2(D) Q6.5(D) Q6.6(D)
N$54: C51.1 INTERNET+USB.61(XI) R33.2 Y2.1
N$55: C29.1 INTERNET+USB.60(XO) R33.1 Y2.2
N$56: INTERNET+USB.21(NLNKA_LED/GPIO1) R34.1
N$57: INTERNET+USB.22(NSPD_LED/GPIO2) R12.1
N$58: CON_ETHERNET.11 R34.2
N$59: POWER_5V.5(EXT) Q2.1(G)
N$60: CON_ETHERNET.6 INTERNET+USB.53(RXN) R37.1
N$61: CON_ETHERNET.3 INTERNET+USB.52(RXP) R38.1
N$62: CON_ETHERNET.2 INTERNET+USB.56(TXN) R39.1
N$63: CON_ETHERNET.1 INTERNET+USB.55(TXP) R11.1
N$64: CON_ETHERNET.4 CON_ETHERNET.5 R41.1
N$65: CON_USB.1-2 INTERNET+USB.3(USBDM3)
N$66: CON_USB.1-3 INTERNET+USB.4(USBDP3)
N$67: CON_USB.2-2 INTERNET+USB.6(NC)
N$68: CON_USB.2-3 INTERNET+USB.7(NC)
N$69: H3.B3,0(MOUNT)
N$70: D9.C D10.A TP4.TP
N$71: GSM1.19(19(MIC_P)) MIC+.TP
N$72: GSM1.20(20(MIC_N)) MIC-.TP
N$73: D5.A L5.2 Q2.3(D)
N$74: D6.A D7.C D10.C R46.2
N$75: CON_ETHERNET.10 R12.2
N$76: GSM1.21(21(SPK_P)) SPK+.TP
N$77: GSM1.22(22(SPK_N)) SPK-.TP
N$78: Q1.3(D) U$3.1(COMP)
N$79: R8.1 R9.2 R47.2 VR2.2(R)
N$80: JP9.1 R6.2 R49.1
N$81: INTERNET+USB.8(NC) JP10.1
N$82: INTERNET+USB.9(NC) JP10.2
N$83: JP6.1 UART.RIB
N$84: JP6.5 UART.DTRB
N$85: JP6.7 UART.CDB
N$86: MUX.13(Y0) R29.1
N$87: C24.2 R15.1 U$3.6(BAT) X5.1
N$88: R7.1 U1.5(PWRGD)
N$89: JP3.2 U2.18(GP6)
N$100: JP3.3 U2.17(GP5)
N$101: JP6.8 UART.DSRA
N$102: JP6.6 UART.CDA
N$103: JP6.4 UART.RIA
N$109: JP3.4 U2.16(GP4)
N$110: JP3.5 U2.15(GP3)
N$111: JP3.6 U2.14(GP2)
N$112: JP3.7 U2.13(GP1)
N$113: JP3.8 U2.12(GP0)
N$114: JP5.1 SJ3.1
N$115: D2.C UEXT.4
N$116: D3.C UEXT1.4
PIN9/MOSI/SDA/TX: JP5.11
PIN28CON1: UEXT1.6
PIN29/SOFT_SCL: JP11.4
PIN_ADC1: C10.2 JP11.1 MUX.3(COM) R3.2
POWER_FET: JP11.6 Q4.1(G)
POWER_SIM900: JP5.17 Q7.1(G)
PPS: SIM68.3(TIMEMARK) UART.DTRA
PRTCTL3: INTERNET+USB.16(PRTCTL3) U$15.4(EN)
RESET_SIM900: JP5.18 Q5.1(G)
RTSA: RS-485.2(/RE) RS-485.3(DE) UART.RTSA
RXD1: R19.2 U$4.2
RXD2: D3.A R50.1 RS-485.1(RO) UART.RXA
RXSIM68: SIM68.21(RXD) UART.TXB
SCK: NFC.30(SCK) U2.1(SCK) U$4.7 UART.SCLK UEXT1.9 UEXT.9
SCL_2: JP8.3 UEXT1.5
SDA_2: JP8.4
SHDN_3.3V: JP5.19 R4.1 U1.1(*SHDN)
TX1_ANTENNA: C36.2 C38.2 R43.2
TX2_ANTENNA: C31.1 C32.1 R44.1
TXD1: R18.2 U$4.1
TXD2: RS-485.4(DI) UART.TXA UEXT1.3
TXSIM68: SIM68.20(TXD) UART.RXB
UEXT1_RXD: D2.A R51.1 U$4.9
UEXT1_TXD: U$4.10 UEXT.3
USB_DM: INTERNET+USB.58(USBDM0) JP1.1 SJ1.1
USB_DM_WIFI: INTERNET+USB.1(USBDM2) SJ1.2 WI-FI.DM-
USB_DP: INTERNET+USB.59(USBDP0) JP2.1 SJ2.1
USB_DP_WIFI: INTERNET+USB.2(USBDP2) SJ2.2 WI-FI.DP+
USB_PWR: C22.1 CON_USB.1-1 CON_USB.2-1 U$15.1(OUT)
VDD: C37.1 C54.1 C58.1 INTERNET+USB.5(VDD33A) INTERNET+USB.10(VDD33A) INTERNET+USB.49(VDD33A) INTERNET+USB.51(VDD33A) INTERNET+USB.54(VDD33A) INTERNET+USB.57(VDD33A) INTERNET+USB.64(VDD33A) L7.2 R11.2 R37.2 R38.2 R39.2 R41.2 ; supply symbol labelled 3.3V_REG, AVCC
VIN_ADC: MUX.5(Y5) R32.2
Unconnected: GSM1.2(2(PWRKEY_OUT)) GSM1.3(3(DTR)) GSM1.4(4(RI)) GSM1.5(5(DCD)) GSM1.6(6(DSR)) GSM1.7(7(CTS)) GSM1.8(8(RTS)) GSM1.11(11(DISP_CLK)) GSM1.12(12(DISP_DATA)) GSM1.13(13(DISP_D/C)) GSM1.14(14(DISP_CS)) GSM1.23(23(LINEIN_R)) GSM1.24(24(LINEIN_L)) GSM1.25(25(ADC)) GSM1.27(27(DBG_TXD)) GSM1.28(28(DBG_RXD)) GSM1.34(34(SIM_PRESENCE)) GSM1.35(35(PWM1)) GSM1.36(36(PWM2)) GSM1.37(37(SDA)) GSM1.38(38(SCL)) GSM1.40(40(GPIO1/KBR4)) GSM1.41(41(GPIO2/KBR3)) GSM1.42(42(GPIO3/KBR2)) GSM1.43(43(GPIO4/KBR1)) GSM1.44(44(GPIO5/KBR0)) GSM1.47(47(GPIO6/KBC4)) GSM1.48(48(GPIO7/KBC3)) GSM1.49(49(GPIO8/KBC2)) GSM1.50(50(GPIO9/KBC1)) GSM1.51(51(GPIO10)) GSM1.52(52(NETLIGHT)) GSM1.66(66(STATUS)) GSM1.67(67(GPIO1)) GSM1.68(68(GPIO12)) H1.B3,0(MOUNT) H4.B3,0(MOUNT) INTERNET+USB.13(TEST1) INTERNET+USB.14(PRTCTL2) INTERNET+USB.17(NC) INTERNET+USB.18(NC) INTERNET+USB.20(NFDX_LED/GPIO0) INTERNET+USB.23(EECLK) INTERNET+USB.24(EECS) INTERNET+USB.25(EEDO) INTERNET+USB.26(EEDI) INTERNET+USB.31(TDO) INTERNET+USB.35(GPIO3) INTERNET+USB.36(GPIO4) INTERNET+USB.37(GPIO5) INTERNET+USB.42(GPIO6) INTERNET+USB.43(GPIO7) INTERNET+USB.45(CLK24_OUT) INTERNET+USB.47(TEST4) NFC.12(AUX1) NFC.13(AUX2) NFC.19(P35) NFC.20(NC1) NFC.21(NC2) NFC.22(NC3) NFC.24(P30/UART_RX) NFC.25(IRQ) NFC.26(RSTOUT_N) NFC.31 NFC.32 NFC.33 NFC.34(P34/SIC_CLK) NFC.35(SIGOUT) NFC.36(SIGIN) NFC.37(SVDD) POWER_5V.3(NC) SIM68.1(NC) SIM68.2(SCS) SIM68.4(EINT0) SIM68.5(NC1) SIM68.6(RXD1) SIM68.7(TXD1) SIM68.8(NC4) SIM68.14(MOSI) SIM68.15(MISO) SIM68.16(SCLK) SIM68.17(GPIO0) SIM68.18(SDA) SIM68.19(SCL) SIM68.22(V_BACKUP) SIM_HOLDER.5(VPP) T1.2(C) U2.10(NC_2) U2.11(NC) U$3.5(CHRG) UART.CTSA UART.CTSB UART.RTSB

## Notes on the sheet
- NFC | UEXT
- Pinout of Olinuxino
- ANTENNA MATCHING CIRCUIT
- CON1 | CON2
- 1 | 1
- 2 | 2
- 3 | 3
- 4 | 4
- 5 | 5
- 6 | 6
- 7 | 7
- 8 | 8
- 9 | 9 | UEXT
- 10 | 10
- 11 | 11
- 12 | 12
- 13 | 13
- 14 | 14
- 15 | 15 | DEBUG
- 16 | 16
- 17 | 17
- 18 | 18
- 19 | 19 | AUDIO
- 20 | 20
- 21 | 21
- 22 | 22
- 23 | 23
- 24 | 24
- USB on board | 25 | 25
- 26 | 26
- 27 | 27
- 28 | 28
- 29 | 29
- 30 | 30
- OlinuXino-Micro
- GPIO
- Ethernet
- GPRS-SIM900 | WI-FI
- USB
- GPS
- UART
- tut TVS toje nujen
- PHY&USB-HOSTx2
- Supply | MUX
- RS-485
- tut TVS nujen
- MOD-RS485_rev_A
- ON/OFF

## Power pins joined to a net without a drawn wire
15(VDD_EXT): GSM1.15(15(VDD_EXT))
GND: WI-FI.GND1(GND)
VCC_RF: SIM68.9(VCC_RF)

## Library data of the parts
C1-C7 C9-C17 C19 C20 C22-C25 C27-C33 C35-C39 C44 C46 C48 C51 C54 C58 = rcl:C-EU: CAPACITOR, European symbol
C18 C21 C26 C34 C40 = !!rcl:CPOL-EU: POLARIZED CAPACITOR, European symbol
CON_ETHERNET = CONNECTER:HR911105A
CON_USB = con-cypressindustries:USB_2P-: Triple USB Connector Source: www.cypressindustries.com
D1-D5 = diode:DIODE-: DIODE
D6-D10 = diode:MBRA340T3: Surface Mount Schottky Power Rectifier Source: http://www.onsemi.com/pub_link/Collateral/MBRA340T3-D.PDF
GND JP4 JP9 JP12 JP13 JP15 = !adafruit:PINHD-1X1: Pin header 1x1 for 0.1" spacing With round pins
GSM1 = SIMCOM GSM:SIM900: SIM900, GSM module from SIMCOM
H1-H4 = holes:MOUNT-PAD-ROUND: MOUNTING PAD, round
INTERNET+USB = OLIMEX_IC:LAN9512-JZX
JP1 JP2 JP14 JP16 = pinhead:PINHD-1X1: PIN HEADER
JP3 JP6 = pinhead:PINHD-2X4: PIN HEADER
JP5 = pinhead:PINHD-1X20: PIN HEADER
JP7 JP10 = pinhead:PINHD-1X2: PIN HEADER
JP8 = pinhead:PINHD-1X5: PIN HEADER
JP11 = !adafruit:PINHD-1X8: PIN HEADER
L2-L4 L7 L8 = rcl:L-US: INDUCTOR, American symbol
L5 L6 = !!inductor:DR74: High Power Density, High Efficiency, Shielded Inductors Source: coiltronics_dr_series.pdf
LED2 = led:LED: LED OSRAM: - CHIPLED LG R971, LG N971, LY N971, LG Q971, LY Q971, LO R971, LY R971 LH N974, LH R974 LS Q976, LO Q976, LY Q976 LO Q996 - Hyper CHIPLED LW Q18S LB Q993, LB Q99A, LB R99A - SideLED LS A670, LO A670, LY A670, LG A670, LP A670 LB A673, LV A673, LT A673, LW A673 LH A674 LY A675 LS A676, LA A676, LO A676, LY A676, LW A676 LS A679, LY A679, LG A679 - Hyper Micro SIDELED® LS Y876, LA Y876, LO Y876, LY Y876 LT Y87S - SmartLED LW L88C, LW L88S LB L89C, LB L89S, LG L890 LS L89K, LO L89K, LY L89K LS L896, LA L896, LO L896, LY L896 - TOPLED LS T670, LO T670, LY T670, LG T670, LP T670 LSG T670, LSP T670, LSY T670, LOP T670, LYG T670 LG T671, LOG T671, LSG T671 LB T673, LV T673, LT T673, LW T673 LH T674 LS T676, LA T676, LO T676, LY T676, LB T676, LH T676, LSB T676, LW T676 LB T67C, LV T67C, LT T67C, LS T67K, LO T67K, LY T67K, LW E67C LS E67B, LA E67B, LO E67B, LY E67B, LB E67C, LV E67C, LT E67C LW T67C LS T679, LY T679, LG T679 LS T770, LO T770, LY T770, LG T770, LP T770 LB T773, LV T773, LT T773, LW T773 LH T774 LS E675, LA E675, LY E675, LS T675 LS T776, LA T776, LO T776, LY T776, LB T776 LHGB T686 LT T68C, LB T68C - Hyper Mini TOPLED® LB M676 - Mini TOPLED Santana® LG M470 LS M47K, LO M47K, LY M47K Source: http://www.osram.convergy.de LUXEON: - LUMILED® LXK2-PW12-R00, LXK2-PW12-S00, LXK2-PW14-U00, LXK2-PW14-V00 LXK2-PM12-R00, LXK2-PM12-S00, LXK2-PM14-U00 LXK2-PE12-Q00, LXK2-PE12-R00, LXK2-PE12-S00, LXK2-PE14-T00, LXK2-PE14-U00 LXK2-PB12-K00, LXK2-PB12-L00, LXK2-PB12-M00, LXK2-PB14-N00, LXK2-PB14-P00, LXK2-PB14-Q00 LXK2-PR12-L00, LXK2-PR12-M00, LXK2-PR14-Q00, LXK2-PR14-R00 LXK2-PD12-Q00, LXK2-PD12-R00, LXK2-PD12-S00 LXK2-PH12-R00, LXK2-PH12-S00 LXK2-PL12-P00, LXK2-PL12-Q00, LXK2-PL12-R00 Source: www.luxeon.com KINGBRIGHT: KA-3528ASYC Source: www.kingbright.com
MIC+ MIC- SPK+ SPK- TP3 TP4 = testpad:TP: Test pad
MUX = !SN74HC4851:SN74HC4851PW: 8 channel analog multiplexer; MPN: SN74HC4851PW; OC_FARNELL: 1752944; OC_NEWARK: 50R6478; PACKAGE: TSSOP-16; SUPPLIER: Texas Instruments
NFC = microbuilder:PN532: PN532 - Near Field Communication (NFC) controller Highly integrated transceiver module for contactless communication at 13.56 MHz (14443A/MIFARE, FeliCa, I4443B)
POWER_5V = !!NCP1450:NCP1450
POWERJACK = !!_DC_connector:1
Q1 Q2 Q5 Q7-Q13 = transistor-small-signal:BSS123: N-CHANNEL MOS FET
Q4 = !!FET_DPAK:BUZ24: N-Channel Enhancement MOSFET 100V; 32A; 0,060Ohm
Q6 = transistor-fet:BSL307SP: OptiMOS(R)-P Small-Signal-Transistor P-Channel, Enhancement mode, Logic Level ID -5.5 A Source: http://www.infineon.com/upload/Document/BSL307SP_Rev%201.2.pdf
R1 R3-R51 = rcl:R-EU_: RESISTOR, European symbol
RS-485 = OLIMEX_IC:ADM3483: ADUM3483(SOIC8) RS-485 half duplex transciever
SIM68 = SIM68V:SIM68
SIM_HOLDER = SIMCOM GSM:BIGSIM
SJ1-SJ3 = jumper:SJ: SMD solder JUMPER
T1 = zetex:PNPSOT223: PNP TRANSISTOR; MPN: DJT4030P-13; OC_FARNELL: 1710675; OC_NEWARK: 25R4489
U1 = !!MCP1826:MCP1826T-3302E/DC: IC, LDO, 3.3V, 1A,; MPN: MCP1826T-3302E/DC; OC_FARNELL: 1578429; OC_NEWARK: 08N6499; PACKAGE: SOT223-5; SUPPLIER: Microchip
U2 = MCP23S08:MCP23S08-E/SS: 8BIT I/O EXPANDER, SPI, SMD; MPN: MCP23S08-E/SS; OC_FARNELL: 1292236; OC_NEWARK: 08J8734; PACKAGE: 20SSOP; SUPPLIER: Microchip
U$3 = !_LTC4002:LTC4002-SOIC
U$4 = !adafruit:PINHD-1X10: Pin header 1x10 0.1" spacing With round pins
U$15 = !SY6280:SY6280
UART = !SC16IS752:!SC16IS752
UEXT UEXT1 = pinhead:PINHD-2X5: PIN HEADER
VR2 = v-reg:TL431CLP: VOLTAGE REGULATOR
WI-FI = наш Wi-Fi BL-818822:BL-8188
X1-X3 = con-coax:MC-921: COAX. MICROWAVE CONNECTOR O/D diam 2.1 Source: www.tycoelectronics.com .. Electronics .. ENG_CD_1775146_A2.pdf; OC_FARNELL: unknown; OC_NEWARK: unknown
X4 X14 = con-phoenix-350:1751251: MKDS 1/ 3-3,5 Printklemme Nennstrom: 10 A Bemessungsspannung: 160 V Raster: 3,5 mm Polzahl: 3 Montageart: Löten Anschlussart: Schraubanschluss Anschlussrichtung vom Leiter zur Platine: 0° Source: http://eshop.phoenixcontact.com .. 1751251.pdf; OC_FARNELL: unknown; OC_NEWARK: unknown
X5 = con-phoenix-254:MPT2: PHOENIX CONNECTOR; OC_FARNELL: unknown; OC_NEWARK: unknown
X6 = !!con-phoenix-350:1751264: MKDS 1/ 4-3,5 Printklemme Nennstrom: 10 A Bemessungsspannung: 160 V Raster: 3,5 mm Polzahl: 4 Montageart: Löten Anschlussart: Schraubanschluss Anschlussrichtung vom Leiter zur Platine: 0° Source: http://eshop.phoenixcontact.com .. 1751264.pdf; MPN: 1751264; OC_FARNELL: unknown; OC_NEWARK: 10R0934
X8 = !!con-phoenix-350:1751293: MKDS 1/ 7-3,5 Printklemme Nennstrom: 10 A Bemessungsspannung: 160 V Raster: 3,5 mm Polzahl: 7 Montageart: Löten Anschlussart: Schraubanschluss Anschlussrichtung vom Leiter zur Platine: 0° Source: http://eshop.phoenixcontact.com .. 1751293.pdf; OC_FARNELL: unknown; OC_NEWARK: unknown
X9 = !!con-phoenix-350:1751248: MKDS 1/ 2-3,5 Printklemme Nennstrom: 10 A Bemessungsspannung: 160 V Raster: 3,5 mm Polzahl: 2 Montageart: Löten Anschlussart: Schraubanschluss Anschlussrichtung vom Leiter zur Platine: 0° Source: http://eshop.phoenixcontact.com .. 1751248.pdf; OC_FARNELL: unknown; OC_NEWARK: unknown
Y1-Y3 = microbuilder:CRYSTAL: Crystals HC49UP - Surface Mount Crystal 4.0MHz 18pF +/-30ppm Surface Mount Crystal [Digikey: 535-9857-1-ND] 12.0 MHz Surface Mount Crystal [Digikey: 535-9869-6-ND] 25.0 MHz Surface Mount Crystal [Digikey: 535-9078-1-ND] 3.2 x 2.5mm - MEMs SMT Crystal 12.0 MHz 8pF 15ppm 3.2 x 2.5mm Crystal [Digikey: -10-70°C: 644-1047-1-ND -40-125°C: 644-1128-1-ND] 16.0 MHz 8pF 15ppm 3.2 x 2.5mm Crystal [Digikey: -10-70°C: 644-1049-1-ND -40-125°C: 644-1129-2-ND] 16.0 MHz 10pF 10ppm 3.2 x 2.5mm Crystal [Digikey: 644-1100-1-ND] 27.12 MHz 18pF 30ppm 3.2 x 2.5mm Crystal [Digikey: 887-1424-1-ND] 27.12MHz 10pF 10ppm 3.2 x 2.5mm Crystal [Digikey: 887-1329-1-ND] 4.9 x 1.8mm - MEMs SMT Crystal 32.768 KHz 12.5pF 20ppm 4.9 x 1.8mm Crystal [Digikey: SE2415CT-ND] Cylinder 32.768KHz Cylinder Crystal

## Net classes
1 PWR: width 0.203 mm, drill 0.4 mm, clearance 0.076 mm